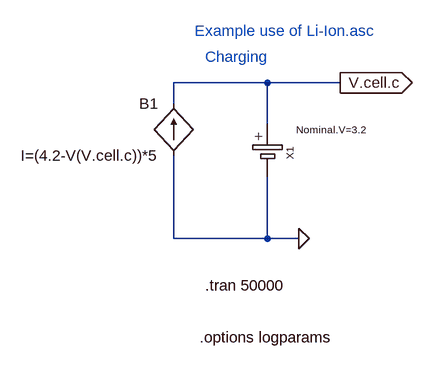
[diagram p0: schematic Charging-Example.asc]
Charging-Example.asc, the LTspice schematic file:
Version 4.1
SHEET 1 880 680
WIRE 224 96 80 96
WIRE 336 96 224 96
WIRE 80 128 80 96
WIRE 224 160 224 96
WIRE 80 336 80 208
WIRE 224 336 224 240
WIRE 224 336 80 336
WIRE 272 336 224 336
FLAG 272 336 0
FLAG 336 96 V.cell.c
IOPIN 336 96 Out
SYMBOL Li-Ion 96 208 R0
WINDOW 39 225 -40 Center 1
SYMATTR InstName X1
SYMATTR Description Lithium-In Battery
SYMATTR SpiceLine Nominal.V=3.2
SYMBOL bi 80 208 R180
WINDOW 0 24 80 Left 2
WINDOW 3 24 0 Left 2
SYMATTR InstName B1
SYMATTR Value I=(4.2-V(V.cell.c))*5
TEXT 128 56 Left 2 ;Charging
TEXT 128 408 Left 2 !.tran 50000
TEXT 120 488 Left 2 !.options logparams
TEXT 112 16 Left 2 ;Example use of Li-Ion.asc

The netlist it stands for:
* Charging-Example.asc
X§X1 V.cell.c 0 Li-Ion Nominal.V=3.2  ; pins cell+ cell-
B1 0 V.cell.c I=(4.2-V(V.cell.c))*5
* Charging
.tran 50000
.options logparams
* Example use of Li-Ion.asc
.backanno
.end